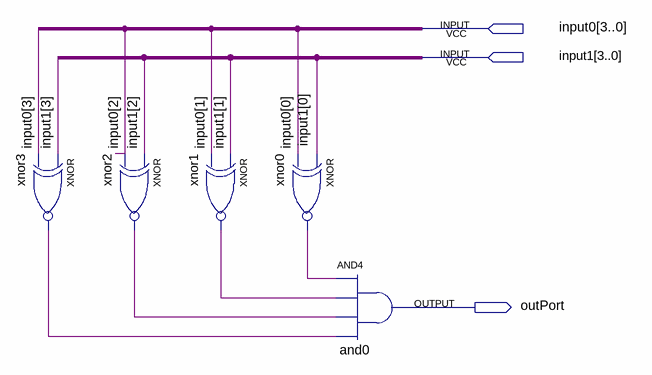
[diagram p0: schematic sheet]
// Quartus schematic EqCmp4.bdf as structural Verilog: 5 symbols, 3 pins
module EqCmp4 (
  input  [3:0] input0,
  input  [3:0] input1,
  output outPort
);

  wire xnor0_out, xnor1_out, xnor2_out, xnor3_out;

  xnor xnor3 (xnor3_out, input1[3], input0[3]);
  xnor xnor2 (xnor2_out, input1[2], input0[2]);
  xnor xnor1 (xnor1_out, input1[1], input0[1]);
  xnor xnor0 (xnor0_out, input1[0], input0[0]);
  and and0 (outPort, xnor0_out, xnor1_out, xnor2_out, xnor3_out);
endmodule
